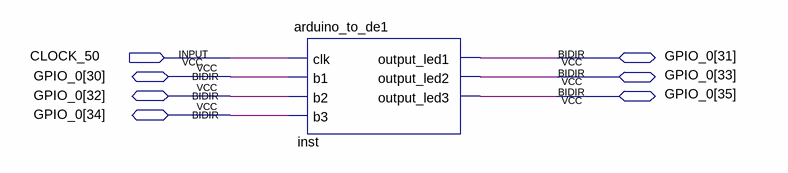
[diagram p0: schematic sheet]
// Quartus schematic Block3.bdf as structural Verilog: 1 symbols, 7 pins
module Block3 (
  input  CLOCK_50,
  inout  [35:30] GPIO_0
);

  arduino_to_de1 inst (
    .clk(CLOCK_50), .b1(GPIO_0[30]), .b2(GPIO_0[32]), .b3(GPIO_0[34]), .output_led1(GPIO_0[31]),
    .output_led2(GPIO_0[33]), .output_led3(GPIO_0[35]));
endmodule
